# EAGLE design PlantSensorFoot (EAGLE 8.1.0)
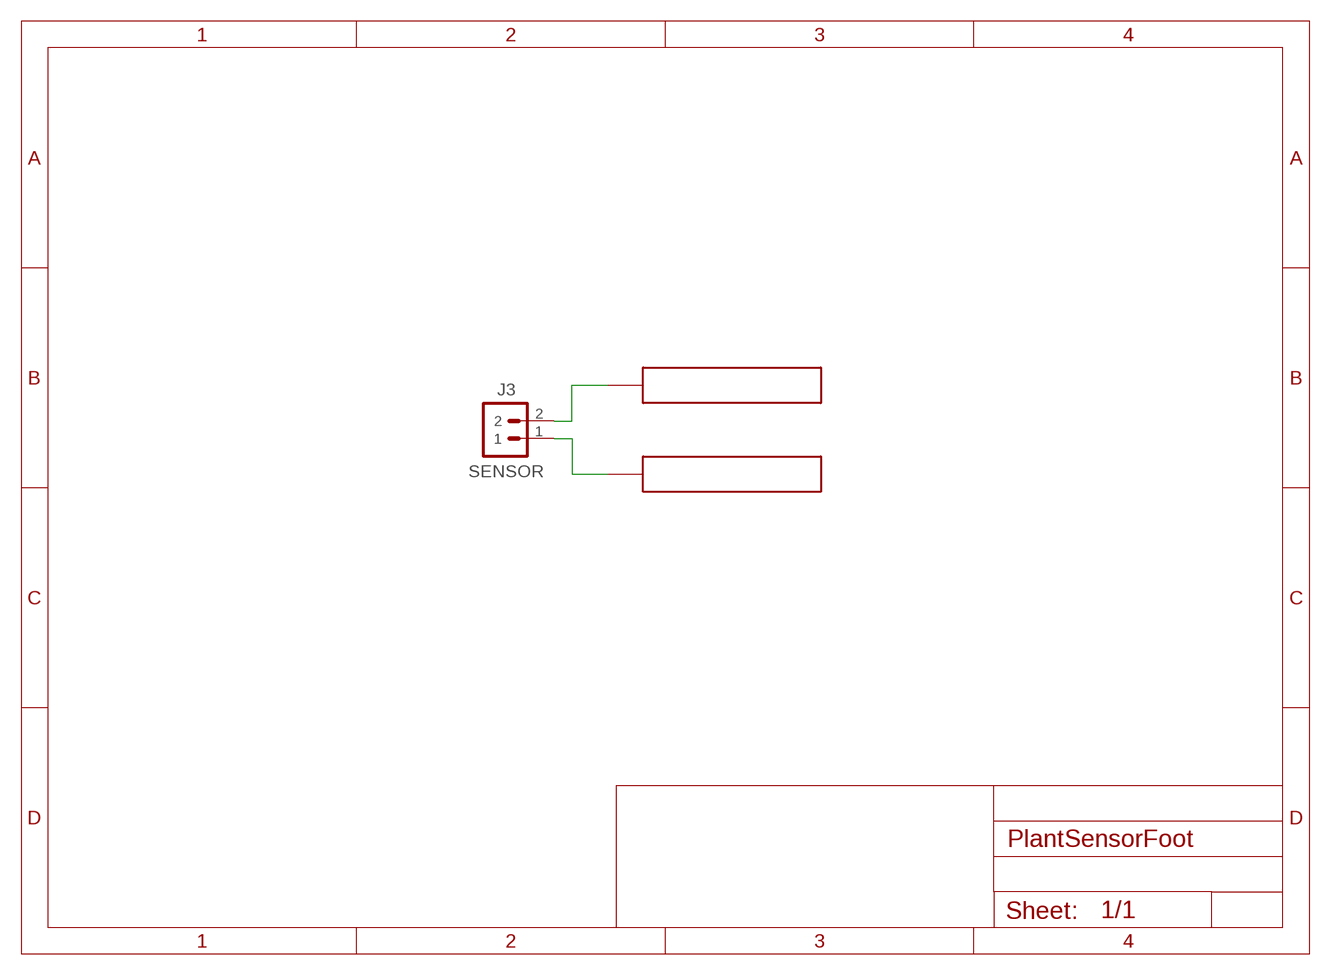
[diagram p0: schematic, sheet 1]

## Parts
CP1  CAP_PAD_5X30  [CAP_PLATE_5X30]
CP2  CAP_PAD_5X30  [CAP_PLATE_5X30]
J3  SENSOR  CON_2X1WIREPADS  [CON_PADS_2XWIRE]

## Nets
SENS1B: CP2.1 J3.1
SENS2B: CP1.1 J3.2

## Library data of the parts
CP1 CP2 = lucky-resistor:CAP_PAD
J3 = lucky-resistor:CON_2X1

## Board
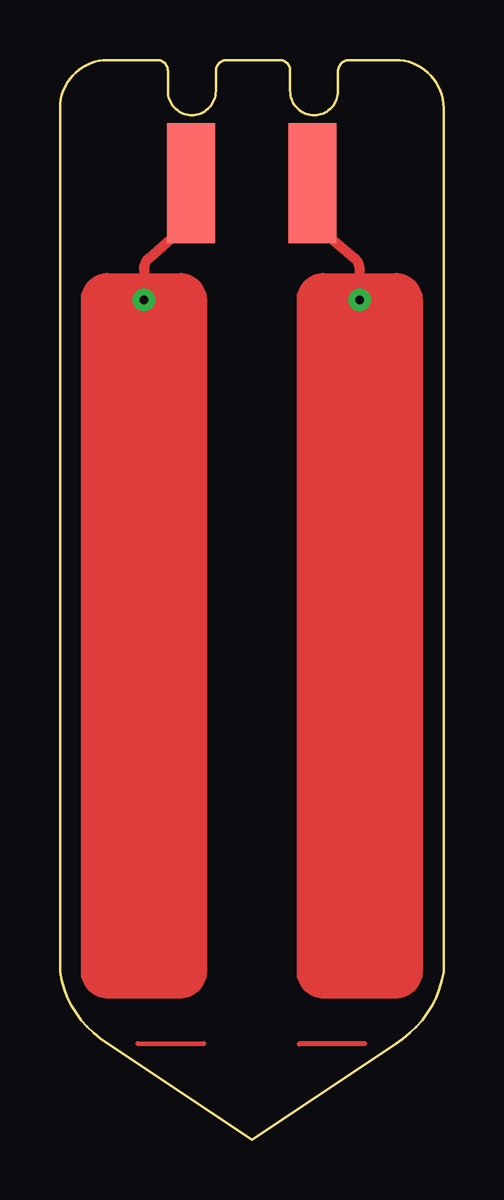
[diagram p1: board, top side]
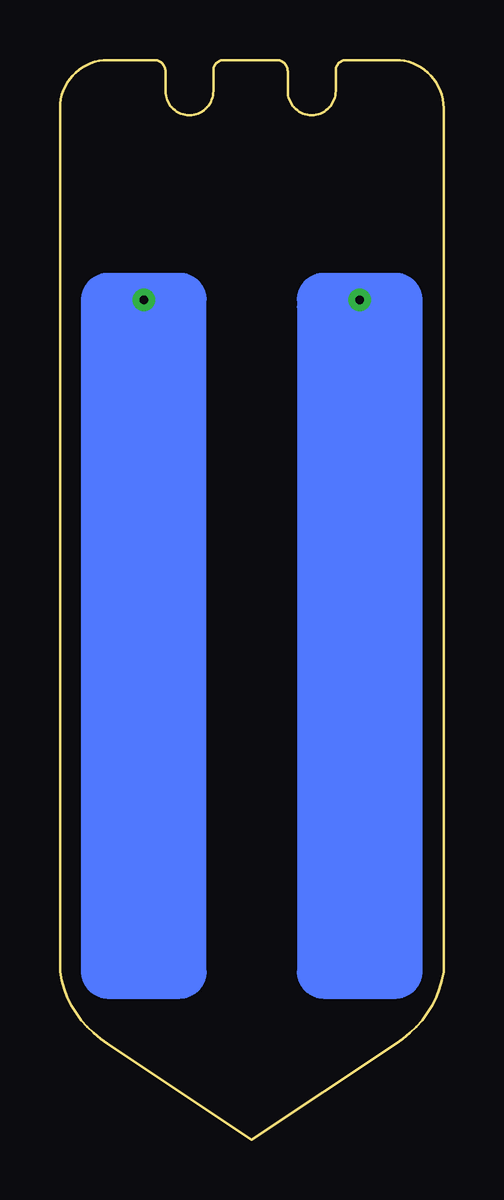
[diagram p2: board, bottom side, seen from below]

Size 16 x 45 mm. Coordinates in mm from the lower left corner, seen from the top.
Outline: 4.5,43.7 arc90 5.5,42.7
Outline: 5.5,42.7 arc90 6.5,43.7
Outline: 6.5,43.7 6.5,44.52 arc-90 6.98,45 9.16,45 arc-90 9.6,44.56 9.6,43.7 arc90 10.6,42.7 arc90 11.6,43.7 11.6,44.52 arc-90 12.08,45 14,45 arc-90 16,43 16,7 arc-50 14,4 8,0 2,4 arc-50 0,7 0,43 arc-90 2,45 4.06,45 arc-90 4.5,44.56 4.5,43.7
Outline: 4.5,43.7 arc90 5.5,42.7
Outline: 5.5,42.7 arc90 6.5,43.7
Copper layers (1*16): Top 0.018mm / dielectric 1.55mm / Bottom 0.018mm
Design rules "eC_2Layer_PClass6_BaseCopperO18_eCDefault": minimum track width 0.15mm, minimum drill 0.35mm, track to track 0.15mm, track to pad 0.15mm, pad to pad 0.15mm, via to via 0.15mm, smd to smd 0mil, copper to edge 0.25mm, drill to drill 0.35mm, minimum pad ring 0.175mm, minimum via ring 0.125mm, stop-mask expansion 0mil, vias tented up to drill 0.45mm, thermal gap 0.2mm

### Footprints (pad centres in the part's own frame; a part is rotated, then mirrored left to right if it is on the bottom)
CAP_PLATE_5X30 = drill 0.35 pad 0.95: 1 1,0
CON_PADS_2XWIRE = smd 2 x 5: 1 -2.54,0; 2 2.54,0

### Placement (x,y rotation side)
CP1  12.5,36 270 top
CP2  3.5,36 270 top
J3  8,39.87 0 top

### Tracks (layer width: path | path; a pad name or v marks a point on that pad's centre or on a via)
N$1
  Top 0.2: 3.26,4 6,4.01
N$2
  Top 0.2: 12.71,3.99 9.98,3.98
SENS1B
  Top 0.406: J3.1 5.4,38.25 3.7,36.73 arc48 3.51,36.3 CP2.1
SENS2B
  Top 0.406: J3.2 10.6,38.17 12.26,36.76 arc-52 12.5,36.28 CP1.1